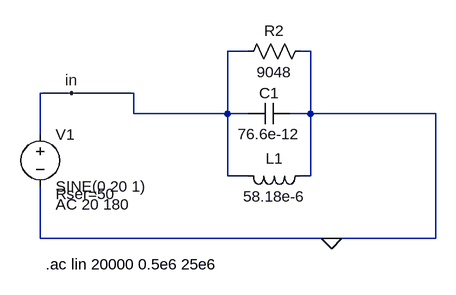
[diagram p0: schematic 1.final_model_with_LC_Values.asc]
1.final_model_with_LC_Values.asc, the LTspice schematic file:
Version 4.1
SHEET 1 880 680
WIRE 112 48 80 48
WIRE 208 48 192 48
WIRE -160 112 -208 112
WIRE -64 112 -160 112
WIRE -64 144 -64 112
WIRE 80 144 80 48
WIRE 80 144 -64 144
WIRE 112 144 80 144
WIRE 208 144 208 48
WIRE 208 144 176 144
WIRE 400 144 208 144
WIRE -208 176 -208 112
WIRE 80 240 80 144
WIRE 112 240 80 240
WIRE 208 240 208 144
WIRE 208 240 192 240
WIRE -208 336 -208 256
WIRE 240 336 -208 336
WIRE 400 336 400 144
WIRE 400 336 240 336
FLAG 240 336 0
FLAG -160 112 in
SYMBOL res 208 32 R90
WINDOW 0 0 56 VBottom 2
WINDOW 3 32 56 VTop 2
SYMATTR InstName R2
SYMATTR Value 9048
SYMBOL cap 176 128 R90
WINDOW 0 0 32 VBottom 2
WINDOW 3 32 32 VTop 2
SYMATTR InstName C1
SYMATTR Value 76.6e-12
SYMBOL ind 208 224 R90
WINDOW 0 5 56 VBottom 2
WINDOW 3 32 56 VTop 2
SYMATTR InstName L1
SYMATTR Value 58.18e-6
SYMBOL voltage -208 160 R0
WINDOW 123 24 124 Left 2
WINDOW 39 24 108 Left 2
SYMATTR Value2 AC 20 180
SYMATTR SpiceLine Rser=50
SYMATTR InstName V1
SYMATTR Value SINE(0 20 1)
TEXT -200 376 Left 2 !.ac lin 20000 0.5e6 25e6

The netlist it stands for:
* 1.final_model_with_LC_Values.asc
R2 0 in 9048
C1 0 in 76.6e-12
L1 0 in 58.18e-6
V1 in 0 SINE(0 20 1) AC 20 180 Rser=50
.ac lin 20000 0.5e6 25e6
.backanno
.end